# EAGLE design Smart-window_v1.1 (EAGLE 9.6.2)
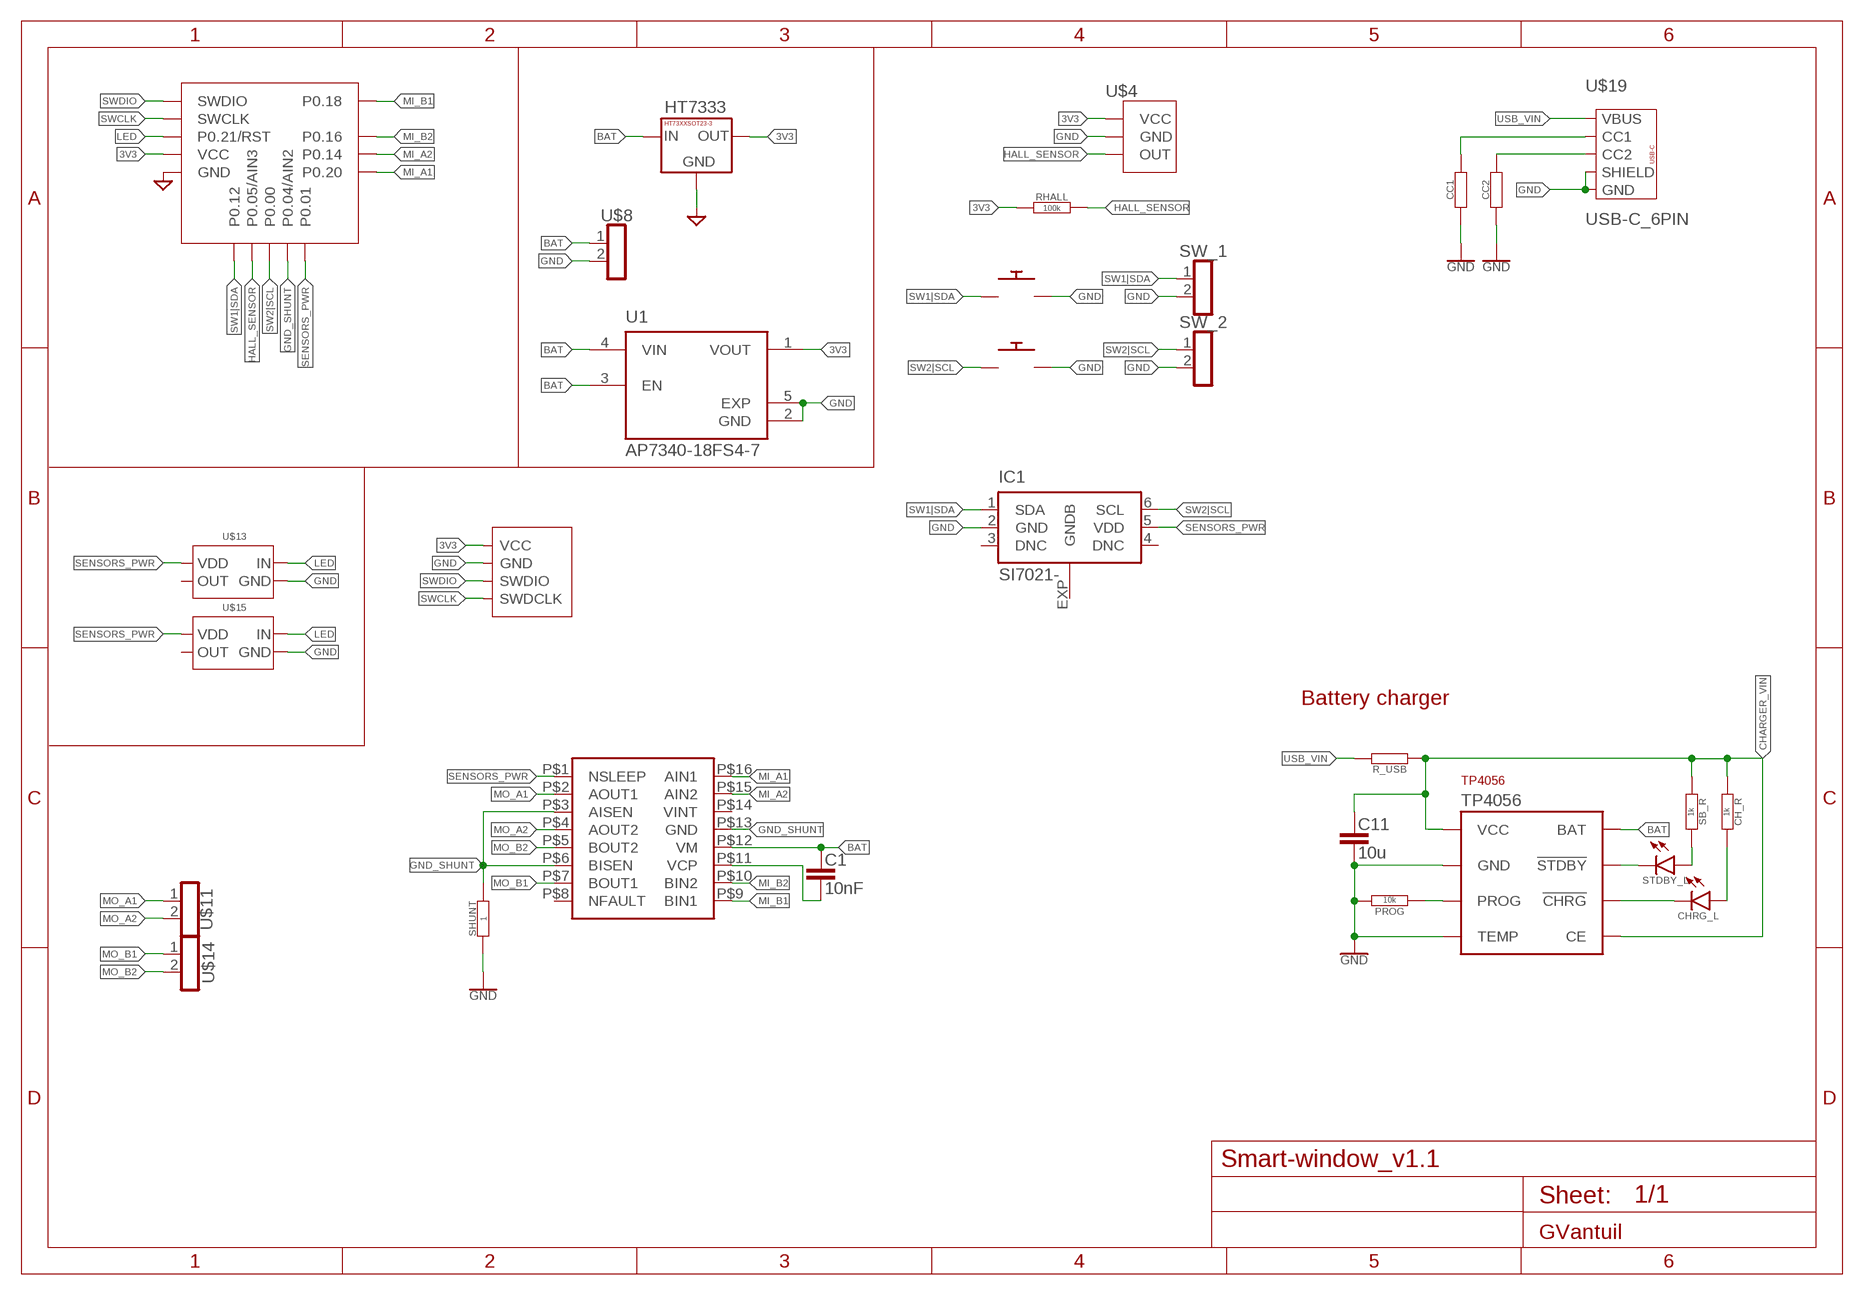
[diagram p0: schematic, sheet 1]

## Parts
C1  10nF  CAP_0402-CAP  [0402-CAP]
C11  10u  CAP_0402-CAP  [0402-CAP]
CC1  RESISTOR0402-RES  [0402-RES]
CC2  RESISTOR0402-RES  [0402-RES]
CH_R  1k  RESISTOR0402-RES  [0402-RES]
CHRG_L  LED_0402  [0402]
HT7333  HT73XXSOT23-3  [SOT23-3]
IC1  SI7021-  [DFN6-3X3]
PROG  10k  RESISTOR0402-RES  [0402-RES]
R_USB  RESISTOR0402-RES  [0402-RES]
RHALL  100k  RESISTOR0402-RES  [0402-RES]
SB_R  1k  RESISTOR0402-RES  [0402-RES]
SHUNT  1  RESISTOR0402-RES  [0402-RES]
STDBY_L  LED_0402  [0402]
SW1  PUSHBUTTON_3X3_SMALL_FOOTPRINT  [PUSHBUTTON_3X3MM_(SMALL_FOOTPRINT)]
SW2  PUSHBUTTON_3X3_SMALL_FOOTPRINT  [PUSHBUTTON_3X3MM_(SMALL_FOOTPRINT)]
SW_1  PINH1X02_2MM  [1X02_2MM]
SW_2  PINH1X02_2MM  [1X02_2MM]
TP4056  TP4056_SOP8  [SOP8]
U1  AP7340-18FS4-7  [VREG_AP7340-18FS4-7]
U$2  E104-BT5005A  [E104-BT5005A]
U$4  49E  [TO92_HALLSENSOR]
U$8  PINH1X02_2MM  [1X02_2MM]
U$9  GV_SWD_4P_SEMI_SMD_SMALL_BACK  [GV_SWD_1.27MM_4P_SEMI_SMD_SMALL_BACK]
U$11  PINH1X02_2MM  [1X02_2MM]
U$12  DRV8833_  [SSOP16]
U$13  SK6805  [LED_ARGB]
U$14  PINH1X02_2MM  [1X02_2MM]
U$15  SK6805  [LED_ARGB]
U$19  USB-C_6PIN  [USCX-06FX-XXMX-01]

## Nets
3V3: HT7333.2(3.OUT) RHALL.1 U1.1(VOUT) U$2.VCC U$4.VCC U$9.VCC U$9.VCC1(VCC)
BAT [pwr]: C1.1 HT7333.3(1.IN) TP4056.P$5(BAT) U1.3(EN) U1.4(VIN) U$8.1 U$12.P$12(VM)
CHARGER_VIN [pwr]: C11.1 CH_R.1 R_USB.1 SB_R.1 TP4056.P$4(VCC) TP4056.P$8(CE)
GND [pwr]: C11.2 CC1.1 CC2.1 HT7333.1(2.GND) IC1.2(GND) PROG.2 SHUNT.1 SW1.1 SW1.2 SW2.1 SW2.2 SW_1.2 SW_2.2 TP4056.P$1(TEMP) TP4056.P$3(GND) U1.2(GND) U1.5(EXP) U$2.GND U$2.GND1(GND) U$4.GND U$8.2 U$9.GND U$9.GND1(GND) U$13.4(GND) U$15.4(GND) U$19.GND1(GND) U$19.GND2(GND) U$19.SHIELD1(SHIELD) U$19.SHIELD2(SHIELD) U$19.SHIELD3(SHIELD) U$19.SHIELD4(SHIELD)
GND_SHUNT [pwr]: SHUNT.2 U$2.P0.04(P0.04/AIN2) U$12.P$3(AISEN) U$12.P$6(BISEN) U$12.P$13(GND)
HALL_SENSOR: RHALL.2 U$2.P0.05(P0.05/AIN3) U$4.OUT
LED: U$2.P0.21/RST U$13.1(IN) U$15.1(IN)
MI_A1: U$2.P0.20 U$12.P$16(AIN1)
MI_A2: U$2.P0.14 U$12.P$15(AIN2)
MI_B1: U$2.P0.18 U$12.P$9(BIN1)
MI_B2: U$2.P0.16 U$12.P$10(BIN2)
MO_A1 [pwr]: U$11.1 U$12.P$2(AOUT1)
MO_A2 [pwr]: U$11.2 U$12.P$4(AOUT2)
MO_B1 [pwr]: U$12.P$7(BOUT1) U$14.1
MO_B2 [pwr]: U$12.P$5(BOUT2) U$14.2
N$2: CHRG_L.C TP4056.P$7(!CHRG)
N$3: C1.2 U$12.P$11(VCP)
N$4: CC2.2 U$19.CC2
N$7: STDBY_L.C TP4056.P$6(!STDBY)
N$9: CC1.2 U$19.CC1
N$14: PROG.1 TP4056.P$2(PROG)
N$16: SB_R.2 STDBY_L.A
N$17: CH_R.2 CHRG_L.A
SENSORS_PWR: IC1.5(VDD) U$2.P0.01 U$12.P$1(NSLEEP) U$13.2(VDD) U$15.2(VDD)
SW1|SDA: IC1.1(SDA) SW1.3 SW1.4 SW_1.1 U$2.P0.12
SW2|SCL: IC1.6(SCL) SW2.3 SW2.4 SW_2.1 U$2.P0.00
SWCLK: U$2.SWCLK U$9.SWDCLK
SWDIO: U$2.SWDIO U$9.SWDIO
USB_VIN [pwr]: R_USB.2 U$19.VBUS1(VBUS) U$19.VBUS2(VBUS)
Unconnected: IC1.3(DNC) IC1.4(DNC) IC1.EXP(GNDB) U$12.P$8(NFAULT) U$12.P$14(VINT) U$13.3(OUT) U$15.3(OUT)

## Notes on the sheet
- Battery charger

## Library data of the parts
C1 C11 = 0000_GV_capacitors:CAP_: Capacitor Standard 0603 ceramic capacitor, and 0.1" leaded capacitor.
CC1 CC2 CH_R PROG R_USB RHALL SB_R SHUNT = 0000_GV_resistors:RESISTOR: Resistor Basic schematic elements and footprints for 0603, 1206, and PTH 1/10th watt (small) resistors.
CHRG_L STDBY_L = 0000_GV_Leds:LED
HT7333 = 0000_GV_regulators:HT73XX
IC1 = 0000_GV_sensors:SI7021-*: I2C Humidity and Temperature Sensor Source: http://www.silabs.com/Support%20Documents/TechnicalDocs/Si7021.pdf
SW1 SW2 = 0000_GV_switches:PUSHBUTTON
SW_1 SW_2 U$8 U$11 U$14 = 0000_GV_connectors:PINH1X02
TP4056 = 0000_GV_batteries:TP4056: TP4056 Data sheet <http://goo.gl/J7k8TF> Dave.Calaway Eagle Library <https://goo.gl/Muy1Tr>
U1 = 0000_GV_regulators:AP7340-18FS4-7: Linear Voltage Regulator IC 1 Output 150mA X2-DFN1010-4 Check availability <https://pricing.snapeda.com/parts/AP7340-18FS4-7/Diodes%20Inc./view-part?ref=eda>; AVAILABILITY: In Stock; CHECK_PRICES: https://www.snapeda.com/parts/AP7340-18FS4-7/Diodes+Inc./view-part/?ref=eda; DESCRIPTION: Linear Voltage Regulator IC Positive Fixed 1 Output 150mA X2-DFN1010-4; MF: Diodes Inc.; MP: AP7340-18FS4-7; PACKAGE: XDFN-4 Diodes Incorporated; PRICE: None; SNAPEDA_LINK: https://www.snapeda.com/parts/AP7340-18FS4-7/Diodes+Inc./view-part/?ref=snap
U$2 = 0000_GV_MCUs:E104-BT5005A
U$4 = 0000_GV_sensors:49E
U$9 = 0000_GV_connectors:GV_SWD_4P
U$12 = 0000_GV_h_bridge:DRV8833_
U$13 U$15 = 0000_GV_Leds:SK6805
U$19 = 0000_GV_connectors:USB-C: AliExpress Special! Connect 5.1k 10% resistors to each CC pin, pulled up to 3.3v or 5.0v.

## Net classes
0 default: width 0.127 mm, drill 0.254 mm
1 pwr: width 0.203 mm, drill 0.406 mm

## Board
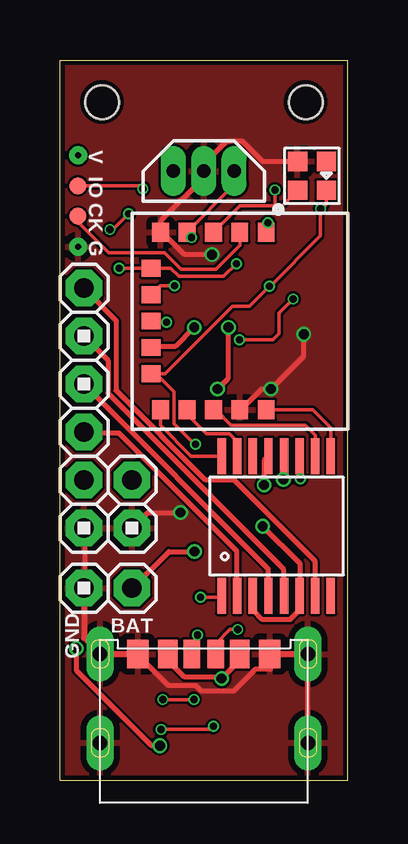
[diagram p1: board, top side]
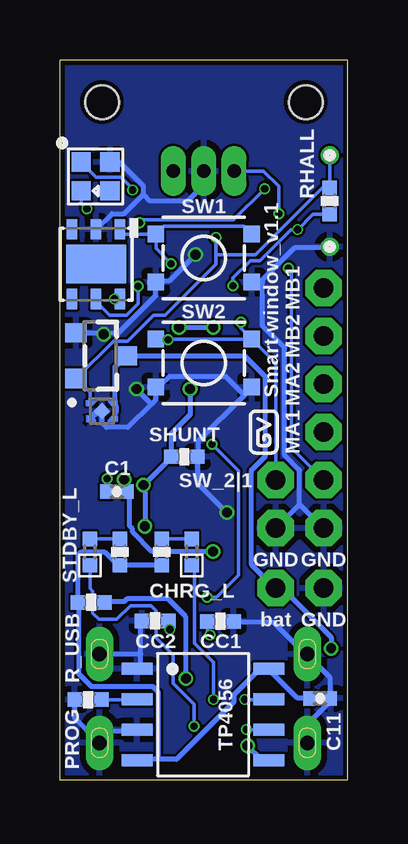
[diagram p2: board, bottom side, seen from below]

Size 12 x 30 mm. Coordinates in mm from the lower left corner, seen from the top.
Outline: 12,0 12,30 0,30 0,0 12,0
Copper layers (1*16): Top 0.035mm / dielectric 1.5mm / Bottom 0.035mm
Design rules "#jlcpcb-2layers *": minimum track width 4mil, minimum drill 0.3mm, track to track 4mil, track to pad 0.1mm, pad to pad 0.15mm, via to via 4mil, smd to smd 0mil, copper to edge 0.2mm, drill to drill 0.2mm, minimum pad ring 0.25mm, minimum via ring 0.075mm, stop-mask expansion 2mil, vias tented up to drill 100mil, thermal gap 10mil
tKeepout: area 9.3,14.2 to 12.5,24

### Footprints (pad centres in the part's own frame; a part is rotated, then mirrored left to right if it is on the bottom)
0402-CAP = smd 0.5 x 0.6: 1 -0.45,0; 2 0.45,0
0402-RES = smd 0.6 x 0.6: 1 -0.55,0; 2 0.55,0
0402 = smd 0.6 x 0.6: A -0.55,0; C 0.55,0
SOT23-3 = smd 0.8 x 0.9: 1 -0.95,-1; 2 0.95,-1; 3 0,1.1
DFN6-3X3 = smd 0.85 x 0.45: 1 -1.45,1; 2 -1.45,0; 3 -1.45,-1; 4 1.45,-1; 5 1.45,0; 6 1.45,1 | smd 1.6 x 2.5: EXP 0,0
PUSHBUTTON_3X3MM_(SMALL_FOOTPRINT) = smd 0.7 x 0.7: 1 -2,1; 2 2,1; 3 -2,-1; 4 2,-1
1X02_2MM = drill 0.813 pad 1.524 octagon: 1 -1,0; 2 1,0
SOP8 = smd 1.3 x 0.5: P$1 -2.75,1.905; P$2 -2.75,0.635; P$3 -2.75,-0.635; P$4 -2.75,-1.905; P$5 2.75,-1.905; P$6 2.75,-0.635; P$7 2.75,0.635; P$8 2.75,1.905
VREG_AP7340-18FS4-7 = smd 0.16 x 0.16: 1 -0.5,0.325; 2 -0.5,-0.325; 3 0.5,-0.325 | smd 0.152 x 0.16: 4 0.5,0.325 | smd 0.48 x 0.48 rotated 45: 5 0,0
E104-BT5005A = smd 0.8 x 0.7: GND -3.7,-3.3; GND1 3.7,0; P0.14 3.7,-2.2; P0.16 3.7,-1.1; P0.18 3.7,1.1; P0.20 3.7,-3.3; P0.21/RST -3.7,-1.1; SWCLK -3.7,0; SWDIO -3.7,1.1; VCC -3.7,-2.2 | smd 0.7 x 0.8: P0.00 0,-3.7; P0.01 2.2,-3.7; P0.04 1.1,-3.7; P0.05 -1.1,-3.7; P0.12 -2.2,-3.7
M1.4_SCREW = hole 1.4: 0,0
TO92_HALLSENSOR = drill 0.55 pad 1.016 long: GND 0,0; OUT -1.27,0; VCC 1.27,0
GV_SWD_1.27MM_4P_SEMI_SMD_SMALL_BACK = drill 0.25 pad 0.4: GND 1.905,0; VCC -1.905,0 | smd 0.7 x 0.7: GND1 1.905,0; SWDCLK 0.635,0; SWDIO -0.635,0; VCC1 -1.905,0
SSOP16 = smd 1.5 x 0.35: P$1 2.9,-2.286; P$2 2.9,-1.636; P$3 2.9,-0.986; P$4 2.9,-0.336; P$5 2.9,0.314; P$6 2.9,0.964; P$7 2.9,1.614; P$8 2.9,2.264; P$9 -2.908,2.264; P$10 -2.908,1.614; P$11 -2.908,0.964; P$12 -2.908,0.314; P$13 -2.908,-0.336; P$14 -2.908,-0.986; P$15 -2.908,-1.636; P$16 -2.908,-2.286
LED_ARGB = smd 0.8 x 0.8: 1 -0.6,-0.6; 2 0.6,-0.6; 3 0.6,0.6; 4 -0.6,0.6
USCX-06FX-XXMX-01 = smd 0.7 x 1.2: CC1 0.5,-1.75; CC2 -0.5,-1.75 | smd 0.9 x 1.2: GND1 2.75,-1.75; GND2 -2.75,-1.75 | drill 0.6 pad 1.143 long: SHIELD1 4.325,1.95; SHIELD2 4.325,-1.75; SHIELD3 -4.35,-1.75; SHIELD4 -4.35,1.95 | smd 0.8 x 1.2: VBUS1 1.5,-1.75; VBUS2 -1.5,-1.75

### Placement (x,y rotation side)
C1  9.63,12.01 180 bottom
C11  1.14,3.4 0 bottom
CC1  5.3,6.61 180 bottom
CC2  8.03,6.63 0 bottom
CH_R  7.75,9.5 90 bottom
CHRG_L  6.5,9.5 270 bottom
HT7333  10.33,17.68 270 bottom
IC1  10.5,21.5 270 bottom
PROG  10.83,3.35 180 bottom
R_USB  10.7,7.4 0 bottom
RHALL  0.75,24.12 270 bottom
SB_R  9.5,9.5 90 bottom
SHUNT  6.81,13.47 180 bottom
STDBY_L  10.75,9.5 270 bottom
SW1  6,21.75 180 bottom
SW2  6,17.38 180 bottom
SW_1  1,11.5 270 top
SW_2  3,11.5 270 top
TP4056  6.03,2.72 0 bottom
U1  10.25,15.38 0 bottom
U$2  7.5,19.12 270 top
U$3  [M1.4_SCREW]  10.25,28.25 0 top
U$4  6,25.38 0 top
U$5  [M1.4_SCREW]  1.75,28.25 0 top
U$8  2,8 180 top
U$9  0.75,24.12 270 top
U$10  [GV_2MM]  3.5,14.5 90 bottom
U$11  1,15.5 90 top
U$12  9.03,10.58 270 top
U$13  10.52,25.15 270 bottom
U$14  1,19.5 270 top
U$15  10.52,25.17 0 top
U$19  6,3.5 180 top

### Tracks (layer width: path | path; a pad name or v marks a point on that pad's centre or on a via)
3V3  (via drill 0.3 pad 0.45)
  Top 0.152: v5.49,22.61 5.49,22.64 U$2.VCC 5.26,22.78 7.27,24.8 U$4.VCC
  Bottom 0.152: U1.1 10.75,16.15 HT7333.2 9.77,18.29 9.17,18.29 8.1,19.36 7.62,19.36 5.49,21.49 5.49,21.89 | 5.49,21.89 v5.49,22.61 | U$9.VCC1 RHALL.1 1.05,24.68 3.83,21.89 5.49,21.89
BAT  (via drill 0.41, 0.41 pad 0.45)
  Top 0.203: v4.17,1.43 3.83,1.43 0.69,4.57 v0.69,5.49 | v5.61,9.52 4.55,9.52 3.03,8 U$8.1
  Top 0.254: U$12.P$12 9.35,12.55 v9.32,12.52
  Bottom 0.203: U1.3 9.72,15.09 9.72,15.26 9.66,15.32 9.66,15.6 9.72,15.66 U1.4 9.72,15.77 9.72,17.2 9.26,17.66 HT7333.3 9.14,17.66 4.29,17.66 3.43,16.8 3.43,13.49 4,12.92 4,8.97 3.09,8.06 U$8.1 2.97,7.94 2.69,7.94 0.69,5.94 v0.69,5.49 | v4.17,1.43 3.6,0.86 3.31,0.86 TP4056.P$5 | v5.61,9.52 8.15,9.52 8.97,10.34 8.97,10.46 9.09,10.57 9.09,11.94 C1.1
  Bottom 0.254: v9.32,12.52 9.32,12.16 C1.1
CHARGER_VIN
  Bottom 0.203: CH_R.1 7.77,8.97 9.49,8.97 SB_R.1 9.6,8.97 10.12,9.49 11.14,9.49 11.26,9.37 11.26,7.43 R_USB.1 11.2,7.32 11.2,4.4 10.69,3.89 8.12,3.89 7.89,3.66 7.89,0.86 | C11.1 1.6,3.43 2.12,3.43 3.26,4.57 TP4056.P$8 3.37,4.63 3.66,4.63 4.74,3.54 4.74,3.26 7.14,0.86 7.89,0.86 | 7.89,0.86 8.74,0.86 TP4056.P$4
GND  (via drill 0.41)
  Top 0.203: U$15.4 9.89,25.77 8.46,25.77 7.6,26.63 6.97,26.63 6.06,25.72 6.06,25.43 U$4.GND 5.94,25.38 5.94,25.03 4.23,23.32 4.23,22.86 U$2.GND 4.29,22.8 5.2,21.89 v6.34,21.89 | U$2.GND1 7.54,15.43 8.4,16.29 v8.8,16.29 10.17,17.66 v10.17,18.57 | U$19.SHIELD3 10.34,5.14 10.34,1.6 U$19.SHIELD4 | 8.75,4.66 8.63,4.63 8.17,4.63 7.26,3.71 5.89,3.71 5.66,3.94 4.51,3.94 3.31,5.14 U$19.GND1 | 0.74,22.23 U$9.GND1 | U$8.2 1.03,8.12 1.03,10.46 SW_1.2 | v5.03,11.14 3.66,11.14 3.03,10.52 SW_2.2
  Top 0.254: TP4056.P$1 8.75,4.66 U$19.GND2 U$19.SHIELD3 | U$19.GND1 U$19.SHIELD2 1,5.92 U$8.2
  Bottom 0.203: 8.52,24.4 8.52,24.75 9.49,25.72 9.89,25.72 U$13.4 | 8.52,24.4 9.31,23.6 9.83,23.6 10.46,22.97 IC1.2 | 8.52,24.4 8.23,24.12 6.67,24.12 6,24.78 U$4.GND | 10.17,18.63 11.32,18.63 HT7333.1 | 10.17,18.63 9.54,18.63 8,20.17 SW1.2 7.94,20.8 7.43,20.8 v6.34,21.89 | 8.18,15.66 8,15.84 8,16.34 SW2.2 7.94,16.46 7.78,16.46 7.44,16.8 5.07,16.8 4.3,16.04 | 8.18,15.66 9.16,14.69 10.06,14.69 10.23,14.86 10.23,15.26 U1.5 | 8.18,15.66 v8.8,16.29 | 4.3,16.04 4,16.34 SW2.1 | 4.3,16.04 6.23,14.12 6.23,13.49 SHUNT.1 6.23,13.37 6.23,12.34 v5.03,11.14 | v10.17,18.57 10.17,18.63 | 8.63,5.26 8.63,4.74 8.74,4.63 TP4056.P$1 | 8.63,5.26 8.63,6.57 CC2.1 | 8.63,5.26 U$19.SHIELD3 | PROG.2 11.37,3.31 11.37,2.57 10.4,1.6 U$19.SHIELD4 10.29,1.6 9.83,2.06 8.8,2.06 TP4056.P$3 | CC1.1 4.74,6.57 3.09,6.57 1.77,5.26 U$19.SHIELD2 1.66,5.2 0.74,4.29 0.74,3.43 C11.2 0.69,3.31 1.66,2.34 1.66,1.6 U$19.SHIELD1 | 3.6,20.8 3.94,20.8 SW1.1 | 3.6,20.8 2.23,22.17 0.8,22.17 U$9.GND1 | 2,11.49 2,12.92 2.63,13.54 2.63,18 3.54,18.92 3.54,20.75 3.6,20.8 | 2,11.49 1.03,10.52 SW_1.2 | 2,11.49 2.97,10.52 SW_2.2
  Bottom 0.254: U1.5 10.43,15.38 U1.2
  pour Bottom: -0.41,32.55 12.34,32.55 12.34,-0.88 -0.41,-0.88
  pour Top: -0.64,-0.56 -0.64,33.66 12.98,33.66 12.98,-0.56
GND_SHUNT  (via drill 0.41)
  Top 0.203: U$12.P$3 8.06,7.66 8.06,7.09 8.46,6.69 9.6,6.69 9.94,7.03 9.94,7.66 U$12.P$6 10,7.77 10,9.03 v8.46,10.57 | v8.52,12.29 8.52,13.32 8.69,13.49 U$12.P$13 | v5.6,18.86 4.8,18.06 3.83,18.06 U$2.P0.04 | v7.03,18.86 7.03,16.75 v6.57,16.29
  Bottom 0.203: v7.03,18.86 v5.6,18.86 | v6.57,16.29 6.57,15.22 7.36,14.43 SHUNT.2 7.37,13.43 v8.52,12.29 8.46,12.23 v8.46,10.57
HALL_SENSOR  (via drill 0.3 pad 0.45)
  Top 0.152: v2.87,23.6 2.21,22.93 v2.08,22.93 | U$2.P0.05 4.17,20.6 v4.78,20.6
  Bottom 0.152: U$4.OUT 3.51,25.38 2.87,24.74 v2.87,23.6 | v4.78,20.6 4.78,20.92 4.06,21.64 3.65,21.64 2.36,22.93 v2.08,22.93 1.44,23.57 RHALL.2
LED  (via drill 0.3 pad 0.45)
  Top 0.152: U$2.P0.21/RST 7.5,23.93 8.97,23.93 | U$15.1 9.27,23.93 8.97,23.93 | v8.97,24.59 8.97,23.93
  Bottom 0.152: U$13.1 10.49,25.12 9.44,25.12 8.97,24.65 v8.97,24.59
MI_A1
  Top 0.152: U$12.P$16 5.48,13.5 4.2,14.78 U$2.P0.20
MI_A2
  Top 0.152: U$2.P0.14 5.3,15.25 6.12,14.42 7.07,14.42 7.4,14.09 U$12.P$15
MI_B1
  Top 0.152: U$12.P$9 11.3,14.69 10.56,15.43 U$2.P0.18
MI_B2
  Top 0.152: U$12.P$10 10.65,14.37 10.24,14.78 7.14,14.78 6.5,15.43 U$2.P0.16
MO_A1
  Top 0.203: U$12.P$2 7.37,7.71 7.37,9.54 2.46,14.46 1.03,14.46 U$11.1
MO_A2
  Top 0.203: U$12.P$4 8.69,7.71 8.69,8.8 1.03,16.46 U$11.2
MO_B1
  Top 0.203: U$12.P$7 10.63,7.71 10.63,9.14 7.26,12.52 6.06,12.52 2.34,16.23 2.34,19.14 1.03,20.46 U$14.1
MO_B2
  Top 0.203: U$12.P$5 9.31,7.71 9.31,8.8 2,16.12 2,17.49 1.03,18.46 U$14.2
N$2  (via drill 0.3 pad 0.45)
  Top 0.152: v5.59,3.35 v4.29,3.35
  Bottom 0.152: CHRG_L.C 6.38,8.82 6.38,5.69 5.59,4.9 v5.59,3.35 | v4.29,3.35 TP4056.P$7
N$3  (via drill 0.3 pad 0.45)
  Top 0.152: v10.03,12.55 10.03,13.46 U$12.P$11
  Bottom 0.152: C1.2 10.08,12.5 v10.03,12.55
N$4  (via drill 0.3 pad 0.45)
  Top 0.152: U$19.CC2 6.5,5.69 7.09,6.27 v7.42,6.27
  Bottom 0.152: CC2.2 7.48,6.34 v7.42,6.27
N$7  (via drill 0.3 pad 0.45)
  Top 0.152: v4.22,2.11 6.27,2.11 v6.4,2.23
  Bottom 0.152: TP4056.P$6 4.2,2.09 v4.22,2.11 | v6.4,2.23 6.4,3.15 7.29,4.04 7.29,5.21 8,5.92 8,7.06 8.2,7.26 9.05,7.26 9.63,6.69 10.37,6.69 10.63,6.95 10.63,7.86 10.75,7.98 STDBY_L.C
N$9  (via drill 0.3 pad 0.45)
  Top 0.152: v5.74,6.04 5.74,5.49 U$19.CC1
  Bottom 0.152: CC1.2 5.85,6.16 v5.74,6.04
N$14
  Bottom 0.152: PROG.1 TP4056.P$2
N$16
  Bottom 0.152: STDBY_L.A SB_R.2
N$17
  Bottom 0.152: CH_R.2 CHRG_L.A
SENSORS_PWR  (via drill 0.3 pad 0.45)
  Top 0.152: v10.87,23.8 10.87,23.75 | 10.87,23.75 10.87,22.68 v8.75,20.56 v8.74,20.57 7.9,19.74 7.19,19.74 4.38,16.93 U$2.P0.01 4,16.93 4.75,16.18 4.75,14.85 5.61,13.99 v5.66,13.99 | v5.87,7.62 6.68,7.62 U$12.P$1 | U$15.2 11.12,23.99 10.87,23.75
  Bottom 0.152: U$13.2 11.12,24.04 v10.87,23.8 | v5.66,13.99 4.55,12.88 4.55,8.53 5.46,7.62 v5.87,7.62 | IC1.5 10.5,19.92 9.93,19.36 9.22,19.36 8.74,19.84 v8.74,20.57
SW1|SDA  (via drill 0.3 pad 0.45)
  Top 0.152: v2.46,21.32 U$2.P0.12 4.61,21.33 4.96,20.98 6.83,20.98 v7.37,21.51
  Bottom 0.152: SW1.4 9.3,22.75 IC1.1 | SW1.3 4.33,23.08 7.67,23.08 SW1.4 | SW1.4 8,22.15 v7.37,21.51 | SW_1.1 2.34,13.84 2.34,21.2 v2.46,21.32
SW2|SCL  (via drill 0.3 pad 0.45)
  Top 0.152: v4.45,19.07 3.85,19.07 U$2.P0.00 | v9.73,20.04 9.14,19.46 9.14,18.59 8.89,18.34 v7.49,18.34
  Bottom 0.152: SW2.3 SW2.4 7.53,18.38 v7.49,18.34 | SW2.3 4.45,18.82 v4.45,19.07 | v9.73,20.04 9.72,20.05 IC1.6 | SW_2.1 3,17.38 SW2.3
SWCLK
  Top 0.152: U$2.SWCLK 7.5,22.28 6.5,21.29 5.05,21.29 4.37,21.97 2.02,21.97 0.75,23.24 U$9.SWDCLK
SWDIO  (via drill 0.3 pad 0.45)
  Top 0.152: U$9.SWDIO 3.33,24.76 v3.45,24.64 | v8.68,23.22 8.68,22.9 U$2.SWDIO
  Bottom 0.152: v8.68,23.22 8.63,23.22 8.52,23.33 4.76,23.33 v3.45,24.64
USB_VIN  (via drill 0.41)
  Top 0.203: U$19.VBUS2 7.49,5.2 7.49,4.97 v6.74,4.23 6.69,4.29 5.2,4.29 4.51,4.97 4.51,5.2 U$19.VBUS1
  Bottom 0.203: v6.74,4.23 6.74,6.8 7.49,7.54 9.2,7.54 9.31,7.43 10.12,7.43 R_USB.2

### Text on the board
tNames: BAT | GND
bNames: MB1 | MB2 | MA2 | MA1 | SW_2|1 | GND | GND | GND | bat